# EasyEDA Pro project Project001.eprj

# Schematic 小车电路原理图
Board Name: Board1; Create Date: 2025-11-09; Page Name: P1; Project Name: Project001; Schematic Name: 小车电路原理图; Update Date: 2025-11-09; Company: 嘉立创EDA; Page Size: A4; Version: V1.0
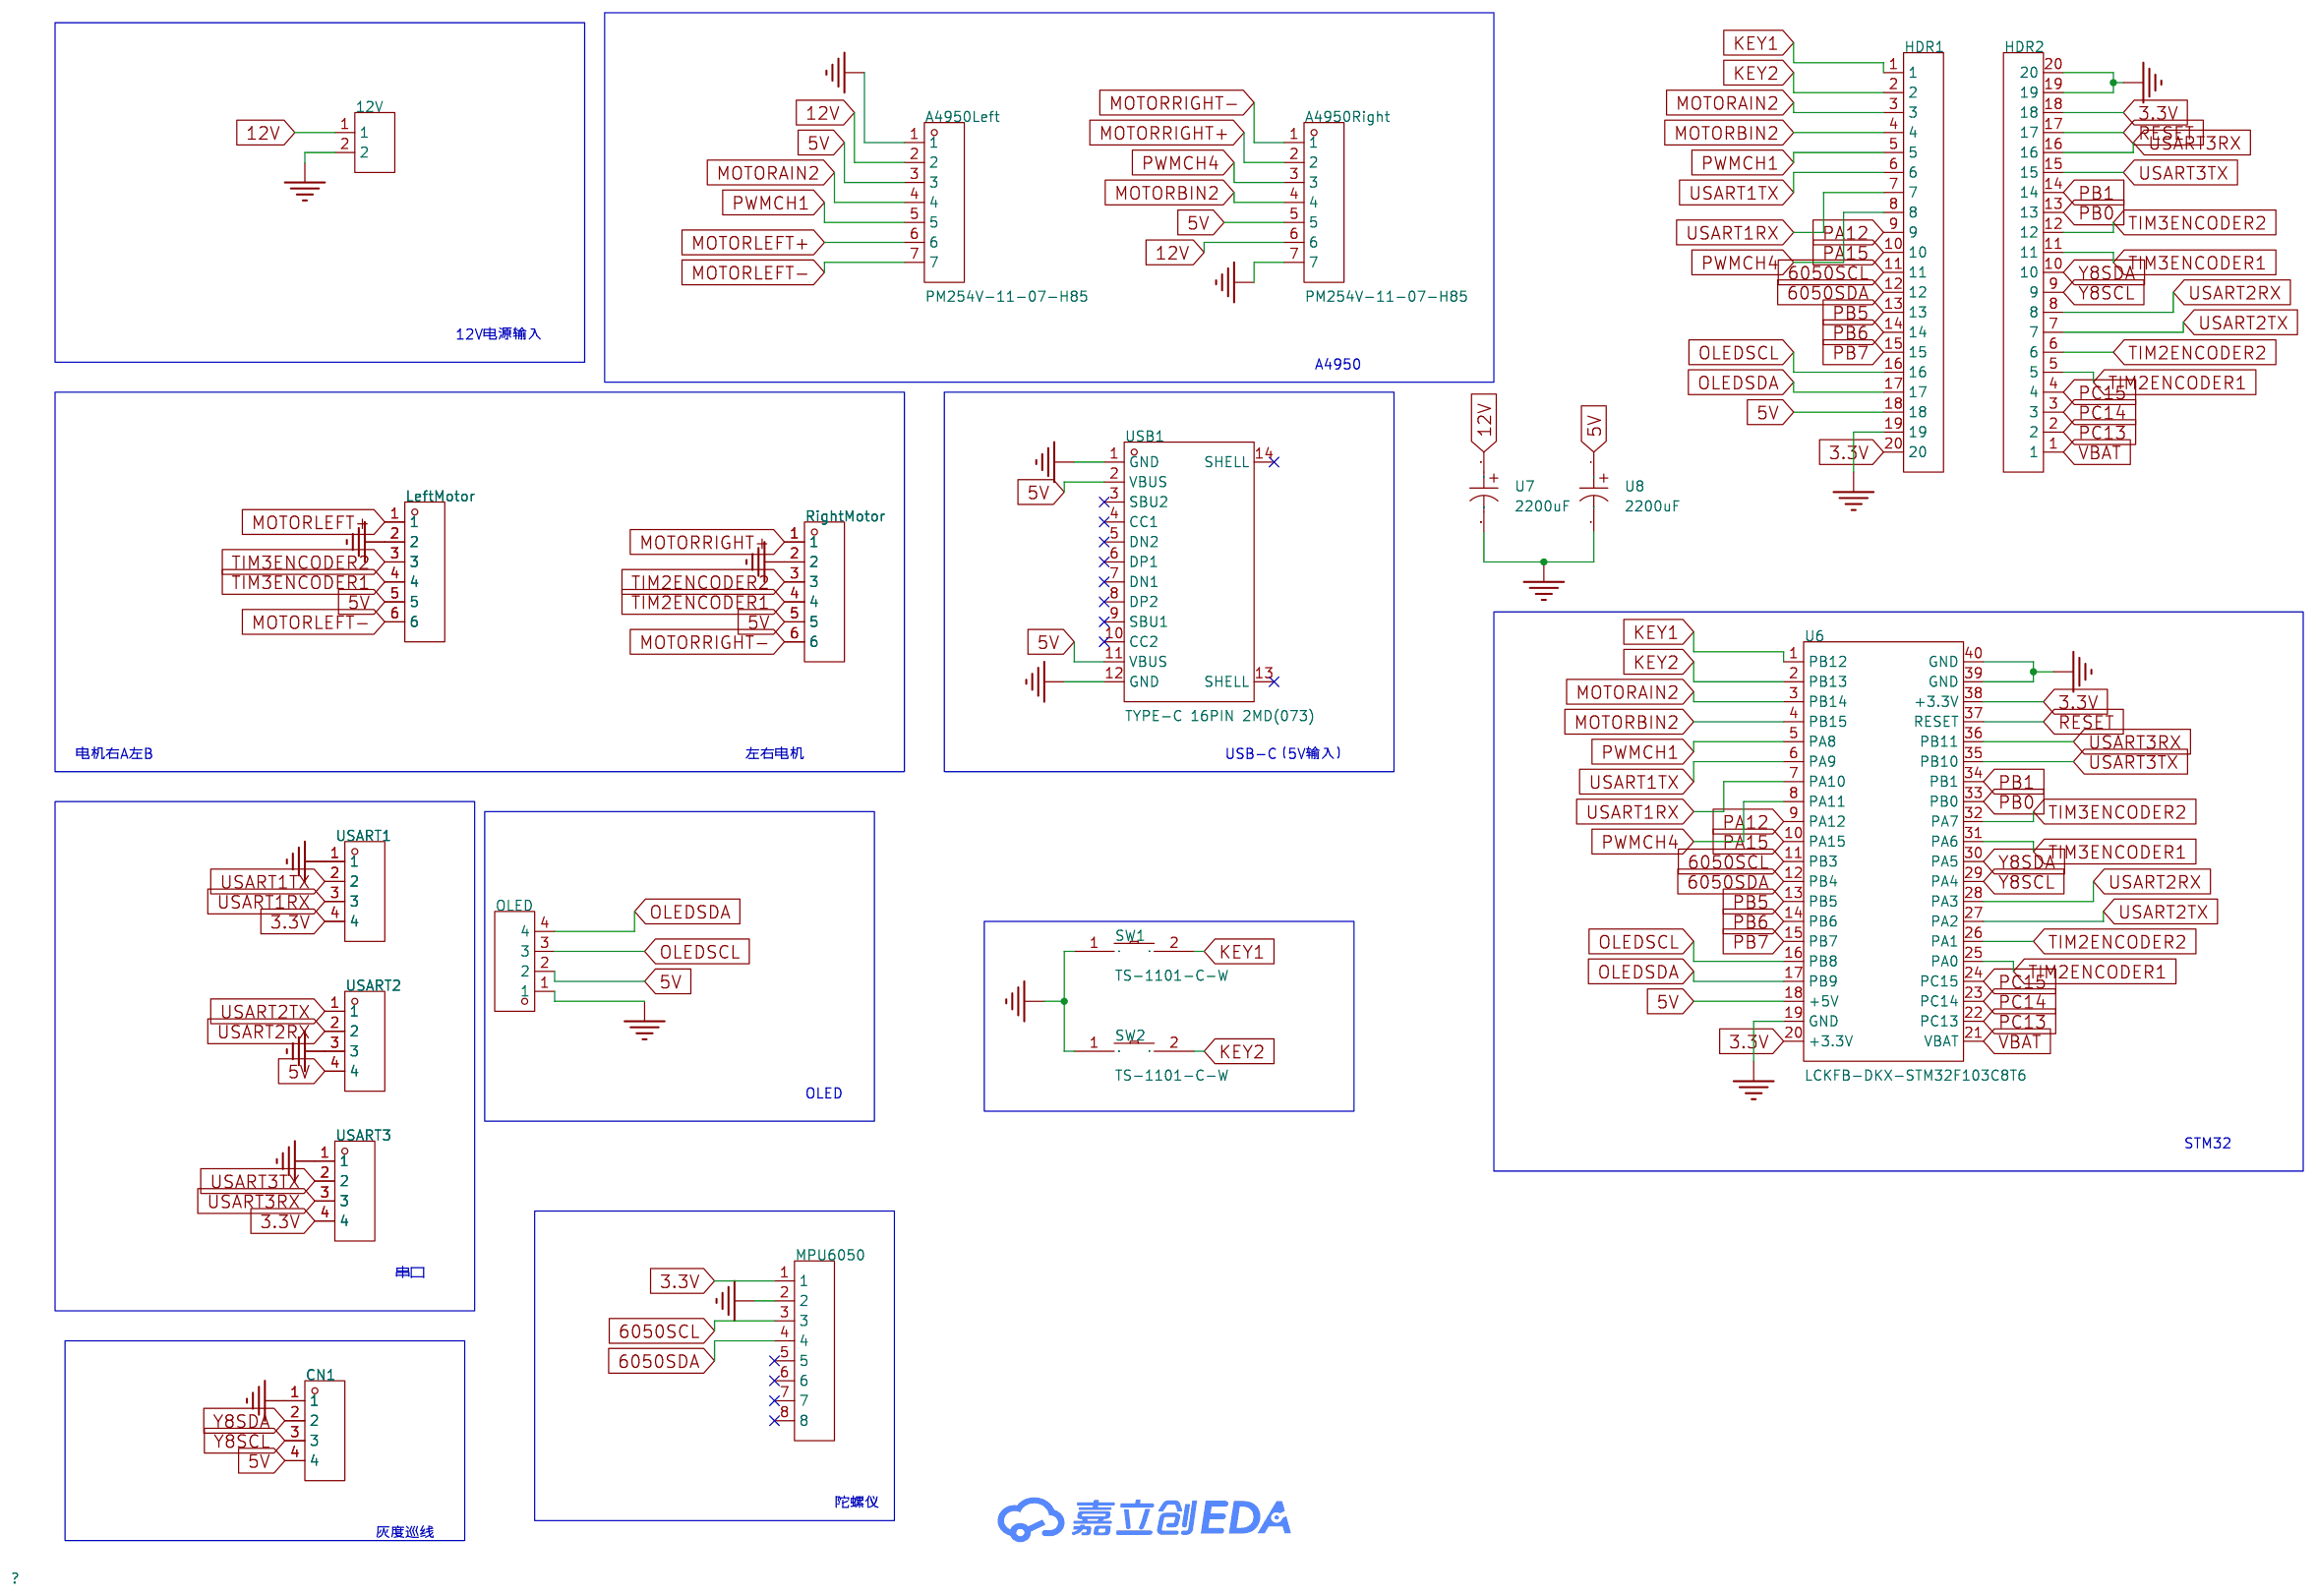
[diagram p0: schematic sheet]

## Parts
12V  12V  [CONN-TH_2P-P2.50_HX25003-2A]
A4950Left  PM254V-11-07-H85  [HDR-TH_7P-P2.54-V-F]
A4950Right  PM254V-11-07-H85  [HDR-TH_7P-P2.54-V-F]
CN1  PH2.0-4P  [CONN-TH_PH2.0-4P]
HDR1  PH2.54-01-20PZD  [HDR-TH_20P-P2.54-V-M-4]
HDR2  PH2.54-01-20PZD  [HDR-TH_20P-P2.54-V-M-4]
LeftMotor  LeftMotor  [CONN-TH_6P-P2.50_ZX-XH2.54-6PZZ]
MPU6050  2.54-1*8P母环保  [HDR-TH_8P-P2.54-V-F_2]
OLED  USART1  [HDR-TH_4P-P2.54-V-F]
RightMotor  RightMotor  [CONN-TH_6P-P2.50_ZX-XH2.54-6PZZ]
SW1  TS-1101-C-W  [SW-SMD_L6.0-W3.3-LS8.0]
SW2  TS-1101-C-W  [SW-SMD_L6.0-W3.3-LS8.0]
U6  LCKFB-DKX-STM32F103C8T6  [CONN-TH_L53.3-W22.9_STM32F103C8T6-CARD]
U7  2200uF  [CAP-TH_BD10.0-P5.00-D0.6-FD-A]
U8  2200uF  [CAP-TH_BD10.0-P5.00-D0.6-FD-A]
USART1  USART1  [HDR-TH_4P-P2.54-V-F]
USART2  USART2  [HDR-TH_4P-P2.54-V-F]
USART3  USART2  [HDR-TH_4P-P2.54-V-F]
USB1  TYPE-C 16PIN 2MD(073)  [USB-C-SMD_TYPE-C-6PIN-2MD-073]

## Library data of the parts
12V = ZX-XH2.54-2PZZ: 插针结构:1x2P;间距:2.5mm;安装方式:直插;参考系列:XH;总PIN数:2P;排数:1;每排PIN数:2;行距:-;额定电流:2A;触头材质:黄铜;触头镀层:锡;工作温度:-25℃~+85℃;; LCSC Part Name: 1x2P 间距:2.5mm 直插 系列:XH; Supplier Part: C7429632; Manufacturer: Megastar(兆星); Supplier Footprint: 插件,P=2.5mm; JLCPCB Part Class: Extended Part; Datasheet: https://item.szlcsc.com/datasheet/ZX-XH2.54-2PZZ/8427549.html; Supplier: LCSC; Pins Structure: 1x2P; Pitch: 2.5mm; Mounting Type: 直插; Reference Series: XH; Number of Pins: 2P; Number of Rows: 1; Number of PINs Per Row: 2; Current Rating: 2A; Contact Material: 黄铜; Contact Plating: 锡; Operating Temperature: -25℃~+85℃; Voltage Rating: 250V; Plastic Material: PA66; Flame Retardant Rating: UL94V-0; Color: 白色; Z-Height of the Board: 7mm; X-Length of Bottom Edge on Board (Spacing Line): 7.5mm; Y-Width of Bottom Edge on Board: 5.9mm
A4950Left A4950Right = PM254V-11-07-H85: 插孔结构:1x7P;间距:2.54mm;行距:-;圆孔/方孔:方孔;安装方式:直插;排数:单排;总孔位数:7P;额定电流:3A;额定电压:250V;插孔方向:顶部;塑高:-;工作温度:-40℃~+105℃;; LCSC Part Name: 间距:2.54mm 1x7P 直插; Supplier Part: C2832270; Manufacturer: XFCN(兴飞); Supplier Footprint: 插件,P=2.54mm; JLCPCB Part Class: 扩展库; Datasheet: https://item.szlcsc.com/datasheet/PM254V-11-07-H85/2989788.html; Supplier: LCSC; Holes Structure: 1x7P; Pitch: 2.54mm; Circular Hole / Square Hole: 方孔; Mounting Type: 直插; Number of Rows: 单排; Number of Positions: 7P; Current Rating: 3A; Voltage Rating (Max): 250V; Holes Direction: 顶部; Operating Temperature: -40℃~+105℃
CN1 = PH2.0-4P_C722763: 插针结构:1x4P;间距:2mm;安装方式:直插;参考系列:-;总PIN数:4P;排数:1;每排PIN数:4;行距:-;额定电流:5A;工作温度:-25℃~+85℃;; LCSC Part Name: 1x4P 间距:2mm 直插; Supplier Part: C722763; Manufacturer: CAX(创都); Supplier Footprint: 插件,P=2mm; JLCPCB Part Class: 扩展库; Datasheet: https://item.szlcsc.com/datasheet/PH2.0-4P/766970.html; Supplier: LCSC; Pins Structure: 1x4P; Pitch: 2mm; Mounting Type: 直插; Number of Pins: 4P; Number of Rows: 1; Number of PINs Per Row: 4; Current Rating: 5A; Operating Temperature: -25℃~+85℃
HDR1 HDR2 = PH2.54-01-20PZD: 插针结构:1x20P;间距:2.54mm;圆针/方针:方针;安装方式:直插;排数:单排;总PIN位数:20P;额定电流:3A;配合针长度:6mm;塑高:2.5mm;端接针长度:3mm;触头材质:黄铜;触头镀层:金;工作温度:-40℃~+105℃;颜色:黑色;; LCSC Part Name: 1x20P 间距:2.54mm 方针 直插; Supplier Part: C7501591; Manufacturer: XUNPU(讯普); Supplier Footprint: 插件,P=2.54mm; JLCPCB Part Class: 扩展库; Datasheet: https://item.szlcsc.com/datasheet/PH2.54-01-20PZD/8584145.html; Supplier: LCSC; Pin Structure: 1x20P; Pitch: 2.54mm; Circluar Pins/Square Pins: 方针; Mounting Type: 直插; Number of Rows: 单排; Number of Pins: 20P; Current Rating: 3A; Length of Mating Pin: 6mm; Insulation Height: 2.5mm; Length of End Connection Pin: 3mm; Contact Material: 黄铜; Contact Plating: 金; Operating Temperature: -40℃~+105℃; Color: 黑色
LeftMotor RightMotor = ZX-XH2.54-6PZZ: 插针结构:1x6P;间距:2.5mm;安装方式:直插;参考系列:XH;总PIN数:6P;排数:1;每排PIN数:6;行距:-;额定电流:3A;触头材质:黄铜;触头镀层:锡;工作温度:-25℃~+85℃;; LCSC Part Name: 1x6P 间距:2.5mm 直插 系列:XH; Supplier Part: C7429636; Manufacturer: Megastar(兆星); Supplier Footprint: 插件,P=2.5mm; JLCPCB Part Class: 扩展库; Datasheet: https://item.szlcsc.com/datasheet/ZX-XH2.54-6PZZ/8427553.html; Supplier: LCSC; Pins Structure: 1x6P; Pitch: 2.5mm; Mounting Type: 直插; Reference Series: XH; Number of Pins: 6P; Number of Rows: 1; Number of PINs Per Row: 6; Current Rating: 3A; Contact Material: 黄铜; Contact Plating: 锡; Operating Temperature: -25℃~+85℃; Voltage Rating: 250V; Plastic Material: PA66; Flame Retardant Rating: UL94V-0; Color: 白色; Z-Height of the Board: 7mm; X-Length of Bottom Edge on Board (Spacing Line): 17.5mm; Y-Width of Bottom Edge on Board: 5.9mm
MPU6050 = 2.54-1*8P母环保: 插孔结构:1x8P;间距:2.54mm;行距:-;圆孔/方孔:方孔;安装方式:直插;排数:单排;总孔位数:8P;插孔方向:顶部;塑高:-;触头材质:-;触头镀层:-;; LCSC Part Name: 1x8P 间距:2.54mm 直插; Supplier Part: C27438; Manufacturer: BOOMELE(博穆精密); Supplier Footprint: 插件,P=2.54mm; JLCPCB Part Class: 扩展库; Datasheet: https://item.szlcsc.com/datasheet/2.54-1*8P%25E6%25AF%258D%25E7%258E%25AF%25E4%25BF%259D/28187.html; Supplier: LCSC; Holes Structure: 1x8P; Pitch: 2.54mm; Circular Hole / Square Hole: 方孔; Mounting Type: 直插; Number of Rows: 单排; Number of Positions: 8P; Holes Direction: 顶部
OLED USART1-USART3 = 2.54-1*4P母: 插孔结构:1x4P;间距:2.54mm;行距:-;圆孔/方孔:方孔;安装方式:直插;排数:单排;总孔位数:4P;额定电流:3A;额定电压:-;插孔方向:顶部;塑高:-;触头材质:青铜;触头镀层:-;工作温度:-40℃~+105℃;; LCSC Part Name: 间距:2.54mm 1x4P 直插; Supplier Part: C2718488; Manufacturer: BOOMELE(博穆精密); Supplier Footprint: 插件,P=2.54mm; JLCPCB Part Class: 扩展库; Datasheet: https://item.szlcsc.com/datasheet/2.54-1*4P%25E6%25AF%258D/2834502.html; Supplier: LCSC; Holes Structure: 1x4P; Pitch: 2.54mm; Circular Hole / Square Hole: 方孔; Mounting Type: 直插; Number of Rows: 单排; Number of Positions: 4P; Current Rating: 3A; Holes Direction: 顶部; Contact Material: 青铜; Operating Temperature: -40℃~+105℃
SW1 SW2 = TS-1101-C-W: 电路结构:单刀单掷;按钮形状:矩形按钮;作用力:260gf;安装方式:立贴;开关长度:6mm;开关宽度:3.6mm;开关高度:2.5mm;带支架:不带;触点电流:50mA;额定电压(AC):-;额定电压(DC):12V;额定功率:-;绝缘电阻:-;带灯:无;机械寿命:5万次;; LCSC Part Name: 6*3.6*2.5mm 立贴 轻触开关; Supplier Part: C318938; Manufacturer: XKB Connectivity(中国星坤); Supplier Footprint: SMD; JLCPCB Part Class: 扩展库; Datasheet: https://atta.szlcsc.com/upload/public/pdf/source/20200227/C318938_C2E53B1EEDE37D980A33616AC086DE53.pdf; Supplier: LCSC; Circuit: 单刀单掷; Actuator Style: 矩形按钮; Operating Force: 260gf; Mounting Style: 立贴; Switch Length: 6mm; Switch Width: 3.6mm; Switch Height: 2.5mm; Strike Gundam: 不带; Contact Current: 50mA; Voltage Rating (DC): 12V; Actuator/Cap Color: 白色带淡绿; With Lamp: 无; Mechanical Life: 5万次; Operating Temperature: -30℃~+85℃
U6 = LCKFB-DKX-STM32F103C8T6: LCSC Part Name: 立创·地阔星-STM32F103C8T6开发板; Supplier Part: C22396880; Manufacturer: 立创开发板; JLCPCB Part Class: 扩展库; Datasheet: https://item.szlcsc.com/datasheet/LCKFB-DKX-STM32F103C8T6/24005615.html; Supplier: LCSC
U7 U8 = CD2882281CM1025VFL: 容值:2200uF;额定电压:16V;; LCSC Part Name: 2200uF 16V; Supplier Part: C7493891; Manufacturer: HRK(鸿瑞凯电子); Supplier Footprint: 插件,D10xL25mm; JLCPCB Part Class: 扩展库; Supplier: LCSC; Voltage Rating: 16V
USB1 = TYPE-C 16PIN 2MD(073): 连接器类型:Type-C;协议标准:-;公母:母;安装方式:卧贴;触点数量:16P;端口数量:1;额定电流 - 电源:3A;工作温度:-25℃~+85℃;; LCSC Part Name: Type-C 母 卧贴; Supplier Part: C2765186; Manufacturer: SHOU HAN(首韩); Supplier Footprint: SMD; JLCPCB Part Class: 扩展库; Datasheet: https://item.szlcsc.com/datasheet/TYPE-C%252016PIN%25202MD(073)/2901843.html; Supplier: LCSC; Connector Type: Type-C; Gender: 母; Mounting Type: 卧贴; Number of Contacts: 16P; Number of Ports: 1; Current Rating-Power: 3A; Voltage Rating: 5V; Connect-Disconnect Life: 5千次; Detection color: 黑色; Operating Temperature: -25℃~+85℃

## Nets
3.3V: HDR1.20 HDR2.18 MPU6050.1 U6.20(+3.3V) U6.38(+3.3V) USART1.4 USART3.4
5V: A4950Left.3 A4950Right.5 CN1.4 HDR1.18 LeftMotor.5 OLED.2 RightMotor.5 U6.18(+5V) U8.1 USART2.4 USB1.2(VBUS) USB1.11(VBUS)
12V: 12V.1 A4950Left.2 A4950Right.6 U7.1
GND: 12V.2 A4950Left.1 A4950Right.7 CN1.1 HDR1.19 HDR2.19 HDR2.20 LeftMotor.2 MPU6050.2 OLED.1 RightMotor.2 SW1.1 SW2.1 U6.19(GND) U6.39(GND) U6.40(GND) U7.2 U8.2 USART1.1 USART2.3 USART3.1 USB1.1(GND) USB1.12(GND)
VBAT: HDR2.1 U6.21(VBAT)
6050SCL: HDR1.11 MPU6050.3 U6.11(PB3)
6050SDA: HDR1.12 MPU6050.4 U6.12(PB4)
KEY1: HDR1.1 SW1.2 U6.1(PB12)
KEY2: HDR1.2 SW2.2 U6.2(PB13)
MOTORAIN2: A4950Left.4 HDR1.3 U6.3(PB14)
MOTORBIN2: A4950Right.4 HDR1.4 U6.4(PB15)
MOTORLEFT+: A4950Left.6 LeftMotor.1
MOTORLEFT-: A4950Left.7 LeftMotor.6
MOTORRIGHT+: A4950Right.2 RightMotor.1
MOTORRIGHT-: A4950Right.1 RightMotor.6
OLEDSCL: HDR1.16 OLED.3 U6.16(PB8)
OLEDSDA: HDR1.17 OLED.4 U6.17(PB9)
PA12: HDR1.9 U6.9(PA12)
PA15: HDR1.10 U6.10(PA15)
PB0: HDR2.13 U6.33(PB0)
PB1: HDR2.14 U6.34(PB1)
PB5: HDR1.13 U6.13(PB5)
PB6: HDR1.14 U6.14(PB6)
PB7: HDR1.15 U6.15(PB7)
PC13: HDR2.2 U6.22(PC13)
PC14: HDR2.3 U6.23(PC14)
PC15: HDR2.4 U6.24(PC15)
PWMCH1: A4950Left.5 HDR1.5 U6.5(PA8)
PWMCH4: A4950Right.3 HDR1.8 U6.8(PA11)
RESET: HDR2.17 U6.37(RESET)
TIM2ENCODER1: HDR2.5 RightMotor.4 U6.25(PA0)
TIM2ENCODER2: HDR2.6 RightMotor.3 U6.26(PA1)
TIM3ENCODER1: HDR2.11 LeftMotor.4 U6.31(PA6)
TIM3ENCODER2: HDR2.12 LeftMotor.3 U6.32(PA7)
USART1RX: HDR1.7 U6.7(PA10) USART1.3
USART1TX: HDR1.6 U6.6(PA9) USART1.2
USART2RX: HDR2.8 U6.28(PA3) USART2.2
USART2TX: HDR2.7 U6.27(PA2) USART2.1
USART3RX: HDR2.16 U6.36(PB11) USART3.3
USART3TX: HDR2.15 U6.35(PB10) USART3.2
Y8SCL: CN1.3 HDR2.9 U6.29(PA4)
Y8SDA: CN1.2 HDR2.10 U6.30(PA5)

Not connected (* = marked no-connect by the designer): MPU6050 5* 6* 7* 8*; USB1 3(SBU2)* 4(CC1)* 5(DN2)* 6(DP1)* 7(DN1)* 8(DP2)* 9(SBU1)* 10(CC2)* 13(SHELL)* 14(SHELL)*

## Notes on the sheet
- 12V电源输入
- A4950
- 电机右A左B
- 左右电机
- USB-C（5V输入）
- OLED
- STM32
- 串口
- 陀螺仪
- 灰度巡线

# Board PCB1
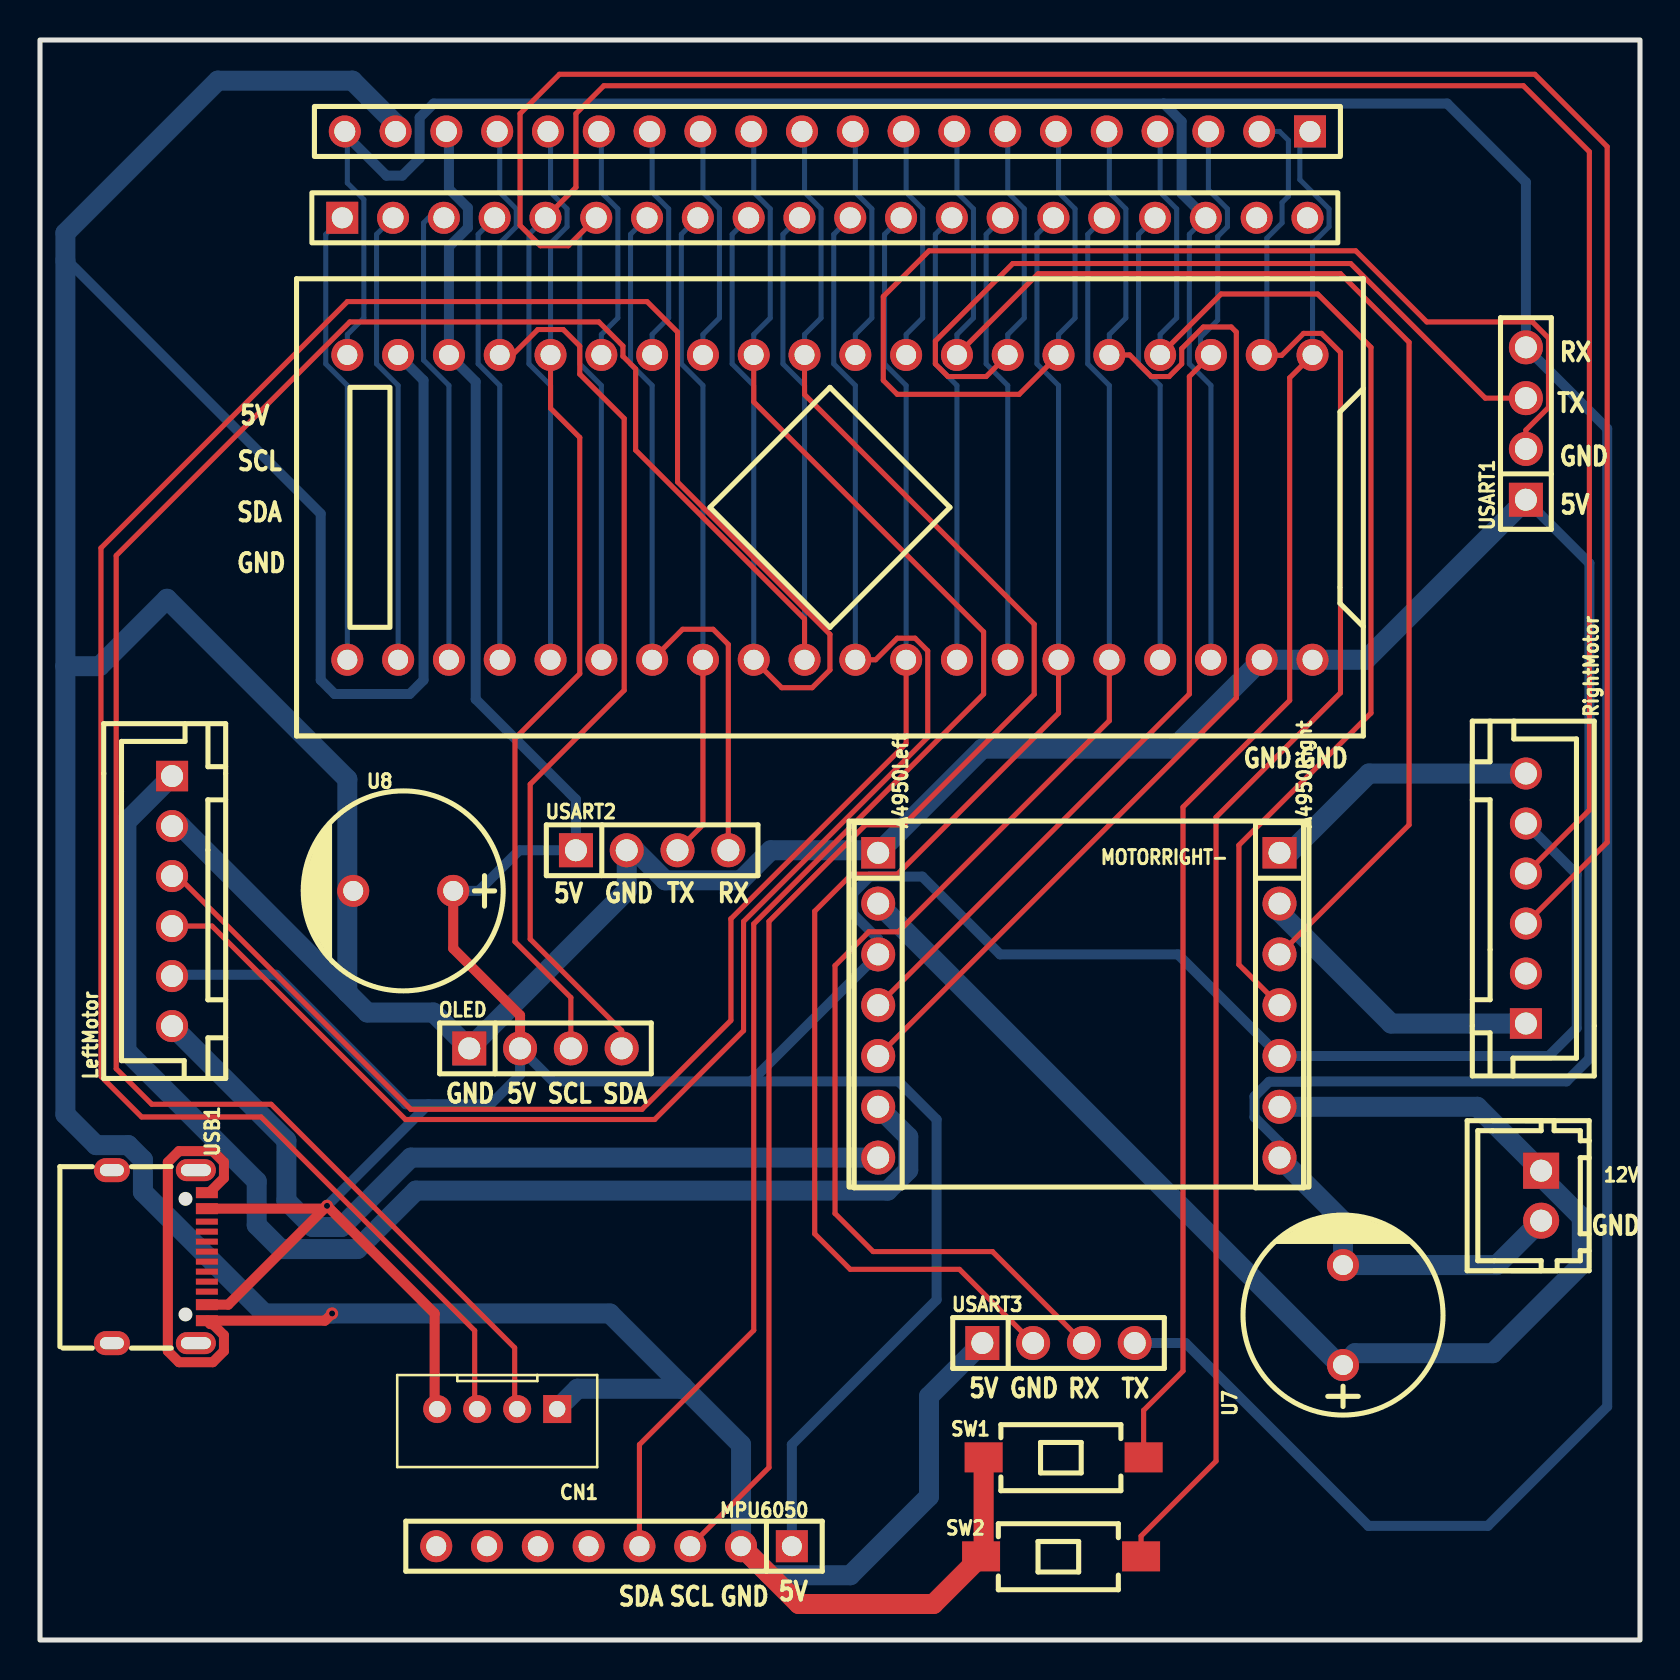
[diagram p1: board, top side]
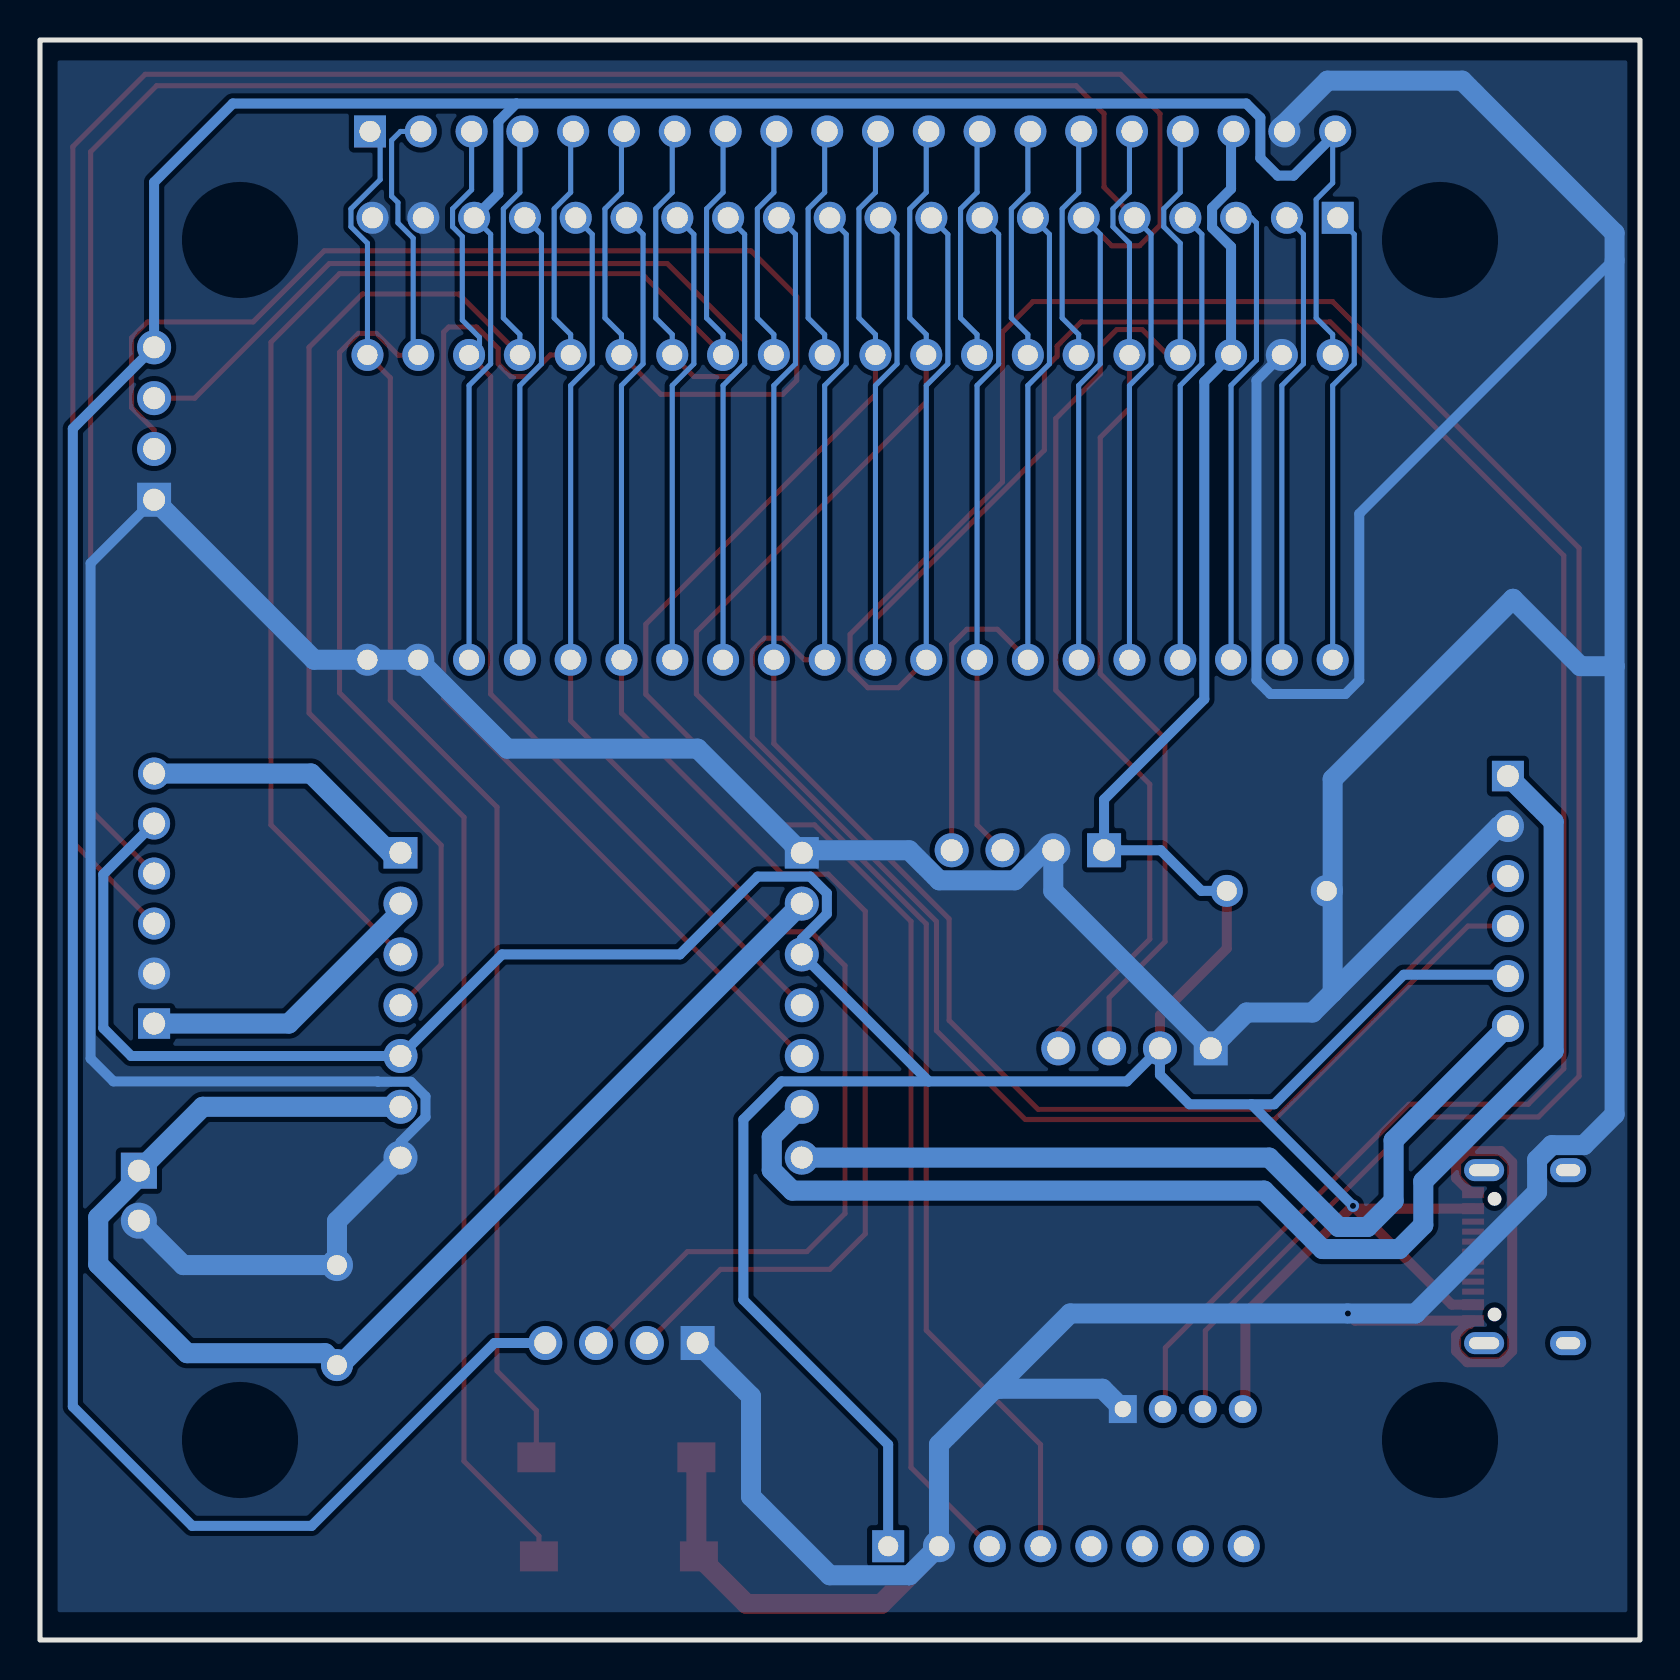
[diagram p2: board, bottom side, seen from below]

Outline 80 x 80 mm; copper layers: Top Layer, Bottom Layer. Coordinates in mm from the lower left corner of the outline.
Outline path: rectangle 0,80 80,0
Stack: Top Layer 0.035mm / Dielectric1 1.51mm FR4 er 4.5 / Bottom Layer 0.035mm

## Design rules (mm)
template: 自定义配置
spacing copperThickness1oz (default): track to track 0.102, other pairs 0.152 to 0.3
spacing copperThickness2oz: track to track 0.203, other pairs 0.152 to 0.3
track width copperThickness1oz (default): min 0.127, default 0.254, max 2.54
track width copperThickness2oz: min 0.203, default 0.254, max 2.54
differential pair differentialPair (default): width min 0.127, default 0.254, max 2.54; gap min 0.152, default 0.152
via viaSize (default): diameter min 0.5, default 0.61, max 10; hole min 0.3, default 0.305, max 6.3

## Placement (name value [footprint] x y rotation side)
12V  12V  [CONN-TH_2P-P2.50_HX25003-2A]  75.06 22.22 270 top
A4950Left  PM254V-11-07-H85  [HDR-TH_7P-P2.54-V-F]  41.91 31.74 270 top
A4950Right  PM254V-11-07-H85  [HDR-TH_7P-P2.54-V-F]  61.98 31.74 270 top
CN1  PH2.0-4P  [CONN-TH_PH2.0-4P]  22.86 11.55 180 top
HDR1  PH2.54-01-20PZD  [HDR-TH_20P-P2.54-V-M-4]  39.37 75.43 180 top
HDR2  PH2.54-01-20PZD  [HDR-TH_20P-P2.54-V-M-4]  39.24 71.11 0 top
LeftMotor  LeftMotor  [CONN-TH_6P-P2.50_ZX-XH2.54-6PZZ]  6.6 36.95 90 top
MPU6050  2.54-1*8P母环保  [HDR-TH_8P-P2.54-V-F_2]  28.7 4.69 180 top
OLED  USART1  [HDR-TH_4P-P2.54-V-F]  25.27 29.58 0 top
RightMotor  RightMotor  [CONN-TH_6P-P2.50_ZX-XH2.54-6PZZ]  74.29 37.07 270 top
SW1  TS-1101-C-W  [SW-SMD_L6.0-W3.3-LS8.0]  51.18 9.13 0 top
SW2  TS-1101-C-W  [SW-SMD_L6.0-W3.3-LS8.0]  51.05 4.18 0 top
U6  LCKFB-DKX-STM32F103C8T6  [CONN-TH_L53.3-W22.9_STM32F103C8T6-CARD]  39.5 56.63 180 top
U7  2200uF  [CAP-TH_BD10.0-P5.00-D0.6-FD-A]  65.15 16.25 90 top
U8  2200uF  [CAP-TH_BD10.0-P5.00-D0.6-FD-A]  18.16 37.45 180 top
USART1  USART1  [HDR-TH_4P-P2.54-V-F]  74.29 60.82 90 top
USART2  USART2  [HDR-TH_4P-P2.54-V-F]  30.61 39.49 0 top
USART3  USART2  [HDR-TH_4P-P2.54-V-F]  50.93 14.85 0 top
USB1  TYPE-C 16PIN 2MD(073)  [USB-C-SMD_TYPE-C-6PIN-2MD-073]  5.97 19.17 270 top

## Footprints (pads in the part's own frame, mm; a bottom-side part is the same pattern mirrored in y, then rotated)
CAP-TH_BD10.0-P5.00-D0.6-FD-A
  round 1.6 hole 1: 1(-2.5,0) 2(2.5,0)
CONN-TH_2P-P2.50_HX25003-2A
  rect 1.8x1.8 hole 1.1: 1(-1.25,0)
  round 1.8 hole 1.1: 2(1.25,0)
CONN-TH_6P-P2.50_ZX-XH2.54-6PZZ
  rect 1.524x1.6 hole 1.1: 1(6.25,0)
  round 1.6 hole 1.1: 2(3.75,0) 3(1.25,0) 4(-1.25,0) 5(-3.75,0) 6(-6.25,0)
CONN-TH_L53.3-W22.9_STM32F103C8T6-CARD
  round 1.6 hole 1: 1(-24.13,-7.62) 2(-21.59,-7.62) 3(-19.05,-7.62) 4(-16.51,-7.62) 5(-13.97,-7.62) 6(-11.43,-7.62) 7(-8.89,-7.62) 8(-6.35,-7.62) 9(-3.81,-7.62) 10(-1.27,-7.62) 11(1.27,-7.62) 12(3.81,-7.62) 13(6.35,-7.62) 14(8.89,-7.62) 15(11.43,-7.62) 16(13.97,-7.62) 17(16.51,-7.62) 18(19.05,-7.62) 19(21.59,-7.62) 20(24.13,-7.62) 21(24.13,7.62) 22(21.59,7.62) 23(19.05,7.62) 24(16.51,7.62) 25(13.97,7.62) 26(11.43,7.62) 27(8.89,7.62) 28(6.35,7.62) 29(3.81,7.62) 30(1.27,7.62) 31(-1.27,7.62) 32(-3.81,7.62) 33(-6.35,7.62) 34(-8.89,7.62) 35(-11.43,7.62) 36(-13.97,7.62) 37(-16.51,7.62) 38(-19.05,7.62) 39(-21.59,7.62) 40(-24.13,7.62)
CONN-TH_PH2.0-4P
  rect 1.4x1.4 hole 0.813: 1(-3,0)
  round 1.4 hole 0.813: 2(-1,0) 3(1,0) 4(3,0)
HDR-TH_4P-P2.54-V-F
  rect 1.7x1.7 hole 1.1: 1(-3.81,0)
  round 1.7 hole 1.1: 2(-1.27,0) 3(1.27,0) 4(3.81,0)
HDR-TH_7P-P2.54-V-F
  rect 1.575x1.7 hole 1.1: 1(-7.62,0)
  round 1.7 hole 1.1: 2(-5.08,0) 3(-2.54,0) 4(0,0) 5(2.54,0) 6(5.08,0) 7(7.62,0)
HDR-TH_8P-P2.54-V-F_2
  rect 1.6x1.6 hole 1: 1(-8.89,0)
  round 1.6 hole 1: 2(-6.35,0) 3(-3.81,0) 4(-1.27,0) 5(1.27,0) 6(3.81,0) 7(6.35,0) 8(8.89,0)
HDR-TH_20P-P2.54-V-M-4
  rect 1.6x1.6 hole 1.05: 1(-24.13,0)
  round 1.6 hole 1.05: 2(-21.59,0) 3(-19.05,0) 4(-16.51,0) 5(-13.97,0) 6(-11.43,0) 7(-8.89,0) 8(-6.35,0) 9(-3.81,0) 10(-1.27,0) 11(1.27,0) 12(3.81,0) 13(6.35,0) 14(8.89,0) 15(11.43,0) 16(13.97,0) 17(16.51,0) 18(19.05,0) 19(21.59,0) 20(24.13,0)
SW-SMD_L6.0-W3.3-LS8.0
  rect 1.9x1.5 smd: 1(-4,0) 2(4,0)
USB-C-SMD_TYPE-C-6PIN-2MD-073
  rect 0.55x1.1 smd: 1(-3.2,2.375) 2(-2.4,2.375) 11(2.4,2.375) 12(3.2,2.375)
  rect 0.3x1.1 smd: 3(-1.75,2.375) 4(-1.25,2.375) 5(-0.75,2.375) 6(-0.25,2.375) 7(0.25,2.375) 8(0.75,2.375) 9(1.25,2.375) 10(1.75,2.375)
  oval 1.1x2 hole 0.6x1.5: 13(-4.325,1.825) 14(4.325,1.825)
  oval 1.2x1.8 hole 0.6x1.2: 13(-4.325,-2.375) 14(4.325,-2.375)

## Nets
As in the schematic, except:
3.3V: HDR1.20 HDR2.18 U6.20 U6.38 USART1.4 USART3.4
5V: A4950Left.3 A4950Right.5 CN1.4 HDR1.18 LeftMotor.5 MPU6050.1 OLED.2 RightMotor.5 U6.18 U8.1 USART2.1 USB1.2 USB1.11
GND: 12V.2 A4950Left.1 A4950Right.7 CN1.1 HDR1.19 HDR2.19 HDR2.20 LeftMotor.2 MPU6050.2 OLED.1 RightMotor.2 SW1.1 SW2.1 U6.19 U6.39 U6.40 U7.2 U8.2 USART1.1 USART2.2 USART3.1 USB1.1 USB1.12
USART2RX: HDR2.8 U6.28 USART2.3
USART2TX: HDR2.7 U6.27 USART2.4

Pads without a net: MPU6050 5 6 7 8; USB1 3 4 5 6 7 8 9 10 13 14

## Via types
v1: diameter 0.61, hole 0.305, Top Layer to Bottom Layer, 2 vias

## Routing (per net, layer and track width the routed paths; a pad name or vN(x,y) marks a point on that pad's centre or on a via; arc(x,y) is an arc through that point)
3.3V: length 198.2
  Bottom Layer w0.254: U6.20 15.37,65.27 16.19,66.1 16.19,72.03 15.37,72.85 15.37,75.17 ; U6.38 58.55,62.73 57.47,63.81 57.47,70.28 HDR2.18
  Bottom Layer w0.5: 56.18,76.83 57.08,75.93 57.08,72.32 HDR2.18 ; 56.18,76.83 19.69,76.83 18.98,76.12 18.98,74.09 18.11,73.22 17.32,73.22 15.37,75.17 15.37,75.3 HDR1.20 ; 56.18,76.83 70.36,76.83 74.29,72.89 USART1.4 78.36,60.57 78.36,11.67 72.39,5.71 66.42,5.71 57.28,14.85 USART3.4
5V: length 222.3
  Top Layer w0.5: USB1.11 9.41,16.77 14.21,21.57 USB1.2 ; U8.1 20.66,34.57 24,31.23 OLED.2 ; CN1.4 19.73,11.67 19.73,16.32 v1(14.35,21.71)
  Bottom Layer w0.5: LeftMotor.5 6.67,33.26 11.81,33.26 18.29,26.79 19.43,26.79 ; MPU6050.1 37.59,9.77 44.83,17.01 44.83,26.03 42.93,27.93 35.56,27.93 ; 19.43,26.79 v1(14.35,21.71) ; 19.43,26.79 22.53,26.79 24,28.26 OLED.2 25.65,27.93 35.56,27.93 ; 35.56,27.93 A4950Left.3 41.91,35.05 40.66,36.3 40.66,37.34 41.49,38.17 44.12,38.17 48.01,34.28 56.9,34.28 A4950Right.5 75.44,29.2 76.84,30.6 76.84,38.28 RightMotor.5 ; U8.1 21.93,37.45 23.96,39.49 USART2.1 26.8,42.03 21.78,47.04 21.78,62.91 U6.18 20.45,69.66 21.4,70.61 21.4,71.61 20.45,72.56 20.45,75.3 HDR1.18
12V: length 66.7
  Bottom Layer w1: A4950Right.6 71.86,26.66 12V.1 75.06,23.16 77.09,21.13 77.09,18.79 72.64,14.34 65.75,14.34 U7.1 64.98,13.75 A4950Left.2
GND: length 417.1
  Top Layer w0.5: v1(14.61,16.33) 14.25,15.97 USB1.12 8.52,15.79 8.64,15.79 9.2,15.24 9.2,14.45 8.64,13.89 6.95,13.89 6.39,14.45 6.39,23.89 6.95,24.44 8.64,24.44 9.2,23.89 9.2,23.1 8.47,22.37 USB1.1
  Top Layer w1: SW1.1 47.18,4.31 SW2.1 44.67,1.8 37.94,1.8 MPU6050.2
  Bottom Layer w0.5: USART1.1 77.47,53.84 77.47,29.07 76.33,27.93 63.12,27.93 63.1,27.91 61.46,27.91 60.72,27.18 60.72,26.14 61.98,24.89 A4950Right.7 ; 1.27,68.98 1.36,68.98 14.04,56.31 14.04,48 14.73,47.3 18.48,47.3 19.18,48 19.18,62.98 U6.19
  Bottom Layer w1: 1.27,48.69 1.27,70.35 8.89,77.97 15.62,77.97 17.78,75.81 HDR1.19 ; 1.27,48.69 2.98,48.69 6.35,52.06 15.37,43.04 15.37,32.38 ; 1.27,48.69 1.27,26.28 2.81,24.74 4.41,24.74 5.15,24.01 5.15,22.4 11.22,16.33 v1(14.61,16.33) 28.5,16.33 32.13,12.69 ; CN1.1 26.88,12.56 32.01,12.56 32.13,12.69 ; USART3.1 44.45,12.18 44.45,7.17 40.51,3.24 36.52,3.24 35.07,4.69 MPU6050.2 35.05,9.77 32.13,12.69 ; 15.37,32.38 7.05,40.7 LeftMotor.2 ; 15.37,32.38 16.37,31.38 19.67,31.38 OLED.1 29.34,37.45 USART2.2 29.75,39.49 31.25,37.98 35.04,37.98 36.54,39.49 41.78,39.49 A4950Left.1 47.12,44.57 56.64,44.57 U6.39 U6.40 66.29,49.01 USART1.1 ; 12V.2 72.84,18.75 U7.2 65.15,20.94 A4950Right.7
VBAT: length 22.9
  Bottom Layer w0.254: HDR2.1 14.29,70.28 14.29,63.81 15.37,62.73 U6.21
6050SCL: length 84.5
  Top Layer w0.254: MPU6050.3 36.45,8.63 36.45,35.93 41.28,40.76 43.18,40.76 49.71,47.29 49.71,50.79 38.23,62.27 U6.11
  Bottom Layer w0.254: U6.11 38.23,65.27 39.05,66.1 39.05,71.56 38.23,72.38 38.23,75.3 HDR1.11
6050SDA: length 83.4
  Top Layer w0.254: U6.12 35.69,61.9 47.18,50.41 47.18,47.3 35.69,35.8 35.69,15.48 29.97,9.77 MPU6050.4
  Bottom Layer w0.254: U6.12 35.69,65.27 36.51,66.1 36.51,71.56 35.69,72.38 35.69,75.3 HDR1.12
KEY1: length 70.9
  Top Layer w0.254: U6.1 62.48,63.11 62.48,46.98 57.15,41.65 57.15,13.45 55.18,11.48 SW1.2
  Bottom Layer w0.254: HDR1.1 62.99,74.92 62.99,73.02 64.45,71.56 64.45,70.66 63.63,69.84 U6.1
KEY2: length 82.1
  Top Layer w0.254: U6.2 61.11,64.23 62.08,64.23 63.18,65.33 64.07,65.33 65.02,64.38 65.02,47.36 58.8,41.14 58.8,8.94 55.05,5.2 SW2.2
  Bottom Layer w0.254: HDR1.2 61.98,75.43 62.42,74.98 62.42,72.19 62.1,71.87 62.1,70.85 61.34,70.09 61.34,64.51 U6.2
MOTORAIN2: length 51.7
  Top Layer w0.254: U6.3 57.47,63.17 57.47,47.3 A4950Left.4
  Bottom Layer w0.254: HDR1.3 58.42,72.51 59.37,71.56 59.37,70.66 58.88,70.17 58.88,65.99 58.03,65.13 58.03,64.77 U6.3
MOTORBIN2: length 61.3
  Top Layer w0.254: U6.4 59.06,67.3 63.88,67.3 66.55,64.63 66.55,46.34 59.94,39.74 59.94,33.77 A4950Right.4
  Bottom Layer w0.254: HDR1.4 56.01,75.3 56.01,72.38 56.83,71.56 56.83,66.1 56.01,65.27 U6.4
MOTORLEFT+: length 64.6
  Bottom Layer w1: A4950Left.6 43.41,25.16 43.41,23.5 42.38,22.47 18.8,22.47 15.88,19.55 12.03,19.55 10.84,20.75 10.84,22.94 4.32,29.45 4.32,40.91 LeftMotor.1
MOTORLEFT-: length 42.7
  Bottom Layer w1: A4950Left.7 18.54,24.12 15.07,20.65 13.63,20.65 12.32,21.96 12.32,24.98 LeftMotor.6
MOTORRIGHT+: length 15
  Bottom Layer w1: RightMotor.1 67.56,30.82 61.98,36.4 A4950Right.2
MOTORRIGHT-: length 14
  Bottom Layer w1: RightMotor.6 66.45,43.32 62.48,39.36 A4950Right.1
OLEDSCL: length 49.7
  Top Layer w0.254: U6.16 25.53,61.58 26.99,60.12 26.99,48.31 23.75,45.08 23.75,34.92 26.54,32.12 OLED.3
  Bottom Layer w0.254: HDR1.16 25.53,75.3 25.53,72.38 26.35,71.56 26.35,70.66 25.53,69.84 U6.16
OLEDSDA: length 56.7
  Top Layer w0.254: OLED.4 29.08,30.47 24.51,35.04 24.51,42.79 29.21,47.49 29.21,61.07 26.99,63.29 26.99,64.7 26.16,65.52 24.89,65.52 23.62,64.25 U6.17
  Bottom Layer w0.254: HDR1.17 22.99,75.3 22.99,72.38 23.81,71.56 23.81,70.66 22.99,69.84 U6.17
PA12: length 11.9
  Bottom Layer w0.254: U6.9 43.31,65.27 44.13,66.1 44.13,71.56 43.31,72.38 43.31,75.3 HDR1.9
PA15: length 11.9
  Bottom Layer w0.254: HDR1.10 40.77,75.3 40.77,72.38 41.59,71.56 41.59,66.1 40.77,65.27 U6.10
PB0: length 22.9
  Bottom Layer w0.254: U6.33 45.85,62.73 44.77,63.81 44.77,70.28 HDR2.13
PB1: length 22.9
  Bottom Layer w0.254: U6.34 48.39,62.73 47.31,63.81 47.31,70.28 HDR2.14
PB5: length 11.9
  Bottom Layer w0.254: HDR1.13 33.15,75.3 33.15,72.38 33.97,71.56 33.97,66.1 33.15,65.27 U6.13
PB6: length 11.9
  Bottom Layer w0.254: HDR1.14 30.61,75.3 30.61,72.38 31.43,71.56 31.43,66.1 30.61,65.27 U6.14
PB7: length 11.9
  Bottom Layer w0.254: U6.15 28.07,65.27 28.89,66.1 28.89,71.56 28.07,72.38 28.07,75.3 HDR1.15
PC13: length 22.9
  Bottom Layer w0.254: HDR2.2 16.83,70.28 16.83,63.81 17.91,62.73 U6.22
PC14: length 23.5
  Bottom Layer w0.254: 20.19,71.11 19.43,71.11 19.18,70.86 19.18,64 20.45,62.73 U6.23
PC15: length 22.9
  Bottom Layer w0.254: U6.24 22.99,62.73 21.91,63.81 21.91,70.28 HDR2.4
PWMCH1: length 63.9
  Top Layer w0.254: U6.5 54.48,64.25 55.56,63.17 56.45,63.17 57.09,63.81 57.09,64.57 58.17,65.65 59.56,65.65 59.82,65.39 59.82,47.11 A4950Left.5
  Bottom Layer w0.254: U6.5 53.47,65.27 54.29,66.1 54.29,71.56 53.47,72.38 53.47,75.3 HDR1.5
PWMCH4: length 70.9
  Top Layer w0.254: A4950Right.3 68.45,40.76 68.45,64.89 65.02,68.32 49.91,68.32 U6.8
  Bottom Layer w0.254: HDR1.8 45.85,75.3 45.85,72.38 46.67,71.56 46.67,66.1 45.85,65.27 U6.8
RESET: length 22.9
  Bottom Layer w0.254: HDR2.17 54.93,70.28 54.93,63.81 56.01,62.73 U6.37
TIM2ENCODER1: length 118.7
  Top Layer w0.254: RightMotor.4 77.47,41.5 77.47,74.41 74.17,77.71 28.19,77.71 26.8,76.32 26.8,72.63 HDR2.5
  Bottom Layer w0.254: U6.25 25.53,62.73 24.45,63.81 24.45,70.28 HDR2.5
TIM2ENCODER2: length 130.5
  Top Layer w0.254: HDR2.6 26.42,69.71 25.02,69.71 24,70.73 24,76.32 25.97,78.29 74.74,78.29 78.36,74.67 78.36,39.89 RightMotor.3
  Bottom Layer w0.254: U6.26 28.07,62.73 26.99,63.81 26.99,70.28 HDR2.6
TIM3ENCODER1: length 84.4
  Top Layer w0.254: U6.31 41.78,49.01 42.86,50.09 43.75,50.09 44.39,49.46 44.39,45.13 35.18,35.93 35.18,30.47 30.73,26.03 18.27,26.03 8.6,35.7 LeftMotor.4
  Bottom Layer w0.254: HDR2.11 39.69,70.28 39.69,63.81 40.77,62.73 U6.31
TIM3ENCODER2: length 79.2
  Top Layer w0.254: LeftMotor.3 6.88,38.2 18.54,26.53 30.1,26.53 34.54,30.98 34.54,36.06 43.31,44.82 U6.32
  Bottom Layer w0.254: HDR2.12 42.23,70.28 42.23,63.81 43.31,62.73 U6.32
USART1RX: length 51.3
  Top Layer w0.254: U6.7 47.31,63.17 45.4,63.17 44.77,63.81 44.77,64.95 48.64,68.82 65.53,68.82 72.26,62.09 USART1.3
  Bottom Layer w0.254: U6.7 48.39,65.27 49.21,66.1 49.21,71.56 48.39,72.38 48.39,75.3 HDR1.7
USART1TX: length 68
  Top Layer w0.254: U6.6 48.96,62.28 42.86,62.28 42.16,62.98 42.16,67.17 44.45,69.46 65.79,69.46 69.34,65.9 74.62,65.9 75.42,65.1 75.42,61.63 74.29,60.5 USART1.2
  Bottom Layer w0.254: HDR1.6 50.93,75.3 50.93,72.38 51.75,71.56 51.75,66.1 50.93,65.27 U6.6
USART2RX: length 32.9
  Top Layer w0.254: U6.28 33.15,40.76 USART2.3
  Bottom Layer w0.254: HDR2.8 32.07,70.28 32.07,63.81 33.15,62.73 U6.28
USART2TX: length 37.9
  Top Layer w0.254: USART2.4 34.42,49.77 33.66,50.54 32.13,50.54 U6.27
  Bottom Layer w0.254: HDR2.7 29.53,70.28 29.53,63.81 30.61,62.73 U6.27
USART3RX: length 72.2
  Top Layer w0.254: USART3.3 47.62,19.42 41.66,19.42 39.75,21.33 39.75,33.72 41.44,35.41 42.91,35.41 53.47,45.96 U6.36
  Bottom Layer w0.254: HDR2.16 52.39,70.28 52.39,63.81 53.47,62.73 U6.36
USART3TX: length 71.2
  Top Layer w0.254: U6.35 50.93,46.34 42.88,38.29 40.59,38.29 38.74,36.44 38.74,20.31 40.51,18.53 45.97,18.53 USART3.2
  Bottom Layer w0.254: U6.35 50.93,62.73 49.85,63.81 49.85,70.28 HDR2.15
Y8SCL: length 136.6
  Top Layer w0.254: CN1.3 21.73,11.67 21.73,15.47 11.05,26.15 5.08,26.15 3.05,28.18 3.05,54.6 15.37,66.92 30.35,66.92 31.88,65.39 31.88,57.9 39.5,50.28 39.5,48.5 38.61,47.61 37.08,47.61 U6.29
  Bottom Layer w0.254: U6.29 35.69,62.73 34.61,63.81 34.61,70.28 HDR2.9
Y8SDA: length 127.5
  Top Layer w0.254: CN1.2 23.73,11.67 23.73,14.61 11.56,26.79 5.59,26.79 3.81,28.56 3.81,54.22 15.49,65.9 27.94,65.9 29.15,64.7 29.15,64.19 29.78,63.55 29.78,59.49 38.23,51.05 U6.30
  Bottom Layer w0.254: U6.30 38.23,62.73 37.15,63.81 37.15,70.28 HDR2.10

## Copper pours and planes (outline as drawn; the poured copper is in the pictures)
GND on Bottom Layer: 0.64,78.98 79.12,78.98 79.12,1.39 0.64,1.39

## Text on the board
Top Silkscreen Layer: MOTORRIGHT- | SDA | GND | SCL | 5V | TX | RX
